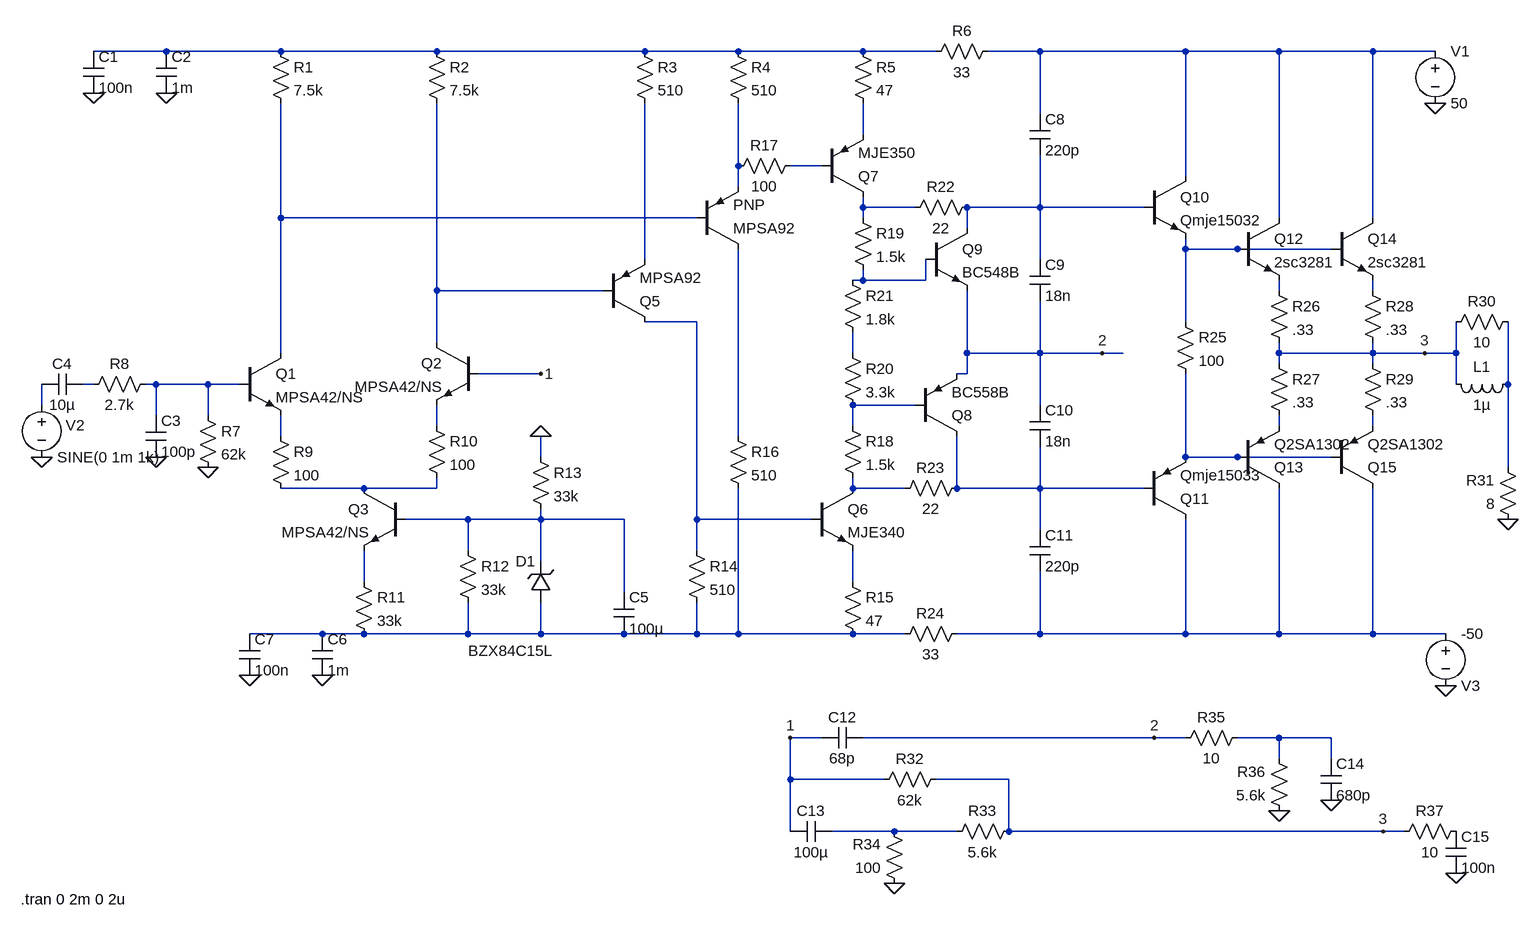
[diagram p0: schematic ampli.asc]
ampli.asc, the LTspice schematic file:
Version 4
SHEET 1 880 872
WIRE -35920 -448 -36032 -448
WIRE -35744 -448 -35920 -448
WIRE -35504 -448 -35744 -448
WIRE -35184 -448 -35504 -448
WIRE -35040 -448 -35184 -448
WIRE -34848 -448 -35040 -448
WIRE -34736 -448 -34848 -448
WIRE -34576 -448 -34656 -448
WIRE -34352 -448 -34576 -448
WIRE -34208 -448 -34352 -448
WIRE -34064 -448 -34208 -448
WIRE -33968 -448 -34064 -448
WIRE -34576 -352 -34576 -448
WIRE -34848 -320 -34848 -368
WIRE -35040 -272 -35040 -368
WIRE -34912 -272 -34960 -272
WIRE -34352 -256 -34352 -448
WIRE -35040 -240 -35040 -272
WIRE -34848 -208 -34848 -224
WIRE -34768 -208 -34848 -208
WIRE -34576 -208 -34576 -288
WIRE -34576 -208 -34688 -208
WIRE -34416 -208 -34576 -208
WIRE -35744 -192 -35744 -368
WIRE -35104 -192 -35744 -192
WIRE -34848 -192 -34848 -208
WIRE -34208 -192 -34208 -448
WIRE -34064 -192 -34064 -448
WIRE -34688 -176 -34688 -208
WIRE -34352 -144 -34352 -160
WIRE -34272 -144 -34352 -144
WIRE -34128 -144 -34272 -144
WIRE -35184 -128 -35184 -368
WIRE -34576 -128 -34576 -208
WIRE -34848 -96 -34848 -112
WIRE -34848 -96 -34864 -96
WIRE -34752 -96 -34752 -128
WIRE -34752 -96 -34848 -96
WIRE -35504 -80 -35504 -368
WIRE -35248 -80 -35504 -80
WIRE -34208 -80 -34208 -96
WIRE -34064 -80 -34064 -96
WIRE -35104 -32 -35184 -32
WIRE -34352 -32 -34352 -144
WIRE -35504 0 -35504 -80
WIRE -35744 16 -35744 -192
WIRE -34864 16 -34864 -16
WIRE -34688 16 -34688 -80
WIRE -34576 16 -34576 -64
WIRE -34576 16 -34688 16
WIRE -34480 16 -34576 16
WIRE -34448 16 -34480 16
WIRE -34208 16 -34208 0
WIRE -34064 16 -34064 0
WIRE -34064 16 -34208 16
WIRE -33984 16 -34064 16
WIRE -33936 16 -33936 -32
WIRE -33936 16 -33984 16
WIRE -34208 32 -34208 16
WIRE -34064 32 -34064 16
WIRE -35344 48 -35440 48
WIRE -34688 48 -34688 16
WIRE -34688 48 -34704 48
WIRE -36032 64 -36048 64
WIRE -35936 64 -35952 64
WIRE -35856 64 -35936 64
WIRE -35808 64 -35856 64
WIRE -33936 64 -33936 16
WIRE -33856 64 -33856 -32
WIRE -36112 96 -36112 64
WIRE -34768 96 -34864 96
WIRE -34576 96 -34576 16
WIRE -35936 112 -35936 64
WIRE -35856 112 -35856 64
WIRE -35504 128 -35504 96
WIRE -34864 128 -34864 96
WIRE -34208 128 -34208 112
WIRE -34064 128 -34064 112
WIRE -35744 144 -35744 112
WIRE -35040 144 -35040 -144
WIRE -35344 176 -35344 144
WIRE -34352 176 -34352 48
WIRE -34272 176 -34352 176
WIRE -34128 176 -34272 176
WIRE -33856 192 -33856 64
WIRE -35616 224 -35744 224
WIRE -35504 224 -35504 208
WIRE -35504 224 -35616 224
WIRE -34864 224 -34864 208
WIRE -34784 224 -34864 224
WIRE -34704 224 -34704 144
WIRE -34576 224 -34576 160
WIRE -34576 224 -34704 224
WIRE -34416 224 -34576 224
WIRE -35456 272 -35552 272
WIRE -35344 272 -35344 256
WIRE -35344 272 -35456 272
WIRE -35216 272 -35344 272
WIRE -35104 272 -35104 -32
WIRE -34928 272 -35104 272
WIRE -34576 288 -34576 224
WIRE -35456 320 -35456 272
WIRE -35104 320 -35104 272
WIRE -35344 336 -35344 272
WIRE -35616 368 -35616 320
WIRE -34864 368 -34864 320
WIRE -35216 384 -35216 272
WIRE -35680 448 -35792 448
WIRE -35616 448 -35680 448
WIRE -35456 448 -35456 400
WIRE -35456 448 -35616 448
WIRE -35344 448 -35344 400
WIRE -35344 448 -35456 448
WIRE -35216 448 -35344 448
WIRE -35104 448 -35104 400
WIRE -35104 448 -35216 448
WIRE -35040 448 -35040 224
WIRE -35040 448 -35104 448
WIRE -34864 448 -35040 448
WIRE -34784 448 -34864 448
WIRE -34576 448 -34576 352
WIRE -34576 448 -34704 448
WIRE -34352 448 -34352 272
WIRE -34352 448 -34576 448
WIRE -34208 448 -34208 224
WIRE -34208 448 -34352 448
WIRE -34064 448 -34064 224
WIRE -34064 448 -34208 448
WIRE -33952 448 -34064 448
WIRE -34912 608 -34960 608
WIRE -34400 608 -34848 608
WIRE -34352 608 -34400 608
WIRE -34208 608 -34272 608
WIRE -34128 608 -34208 608
WIRE -34208 640 -34208 608
WIRE -34128 640 -34128 608
WIRE -34960 672 -34960 608
WIRE -34816 672 -34960 672
WIRE -34624 672 -34736 672
WIRE -34960 752 -34960 672
WIRE -34800 752 -34896 752
WIRE -34704 752 -34800 752
WIRE -34624 752 -34624 672
WIRE -34048 752 -34624 752
WIRE -34016 752 -34048 752
FLAG -35920 -384 0
FLAG -36032 -384 0
FLAG -36112 176 0
FLAG -35936 176 0
FLAG -35856 192 0
FLAG -35344 144 0
FLAG -35792 512 0
FLAG -35680 512 0
FLAG -33968 -368 0
FLAG -33952 528 0
FLAG -33856 272 0
FLAG -35344 48 1
FLAG -34480 16 2
FLAG -33984 16 3
FLAG -34800 832 0
FLAG -34208 720 0
FLAG -34128 704 0
FLAG -34960 608 1
FLAG -34400 608 2
FLAG -33936 816 0
FLAG -34048 752 3
SYMBOL cap -36048 -448 R0
SYMATTR InstName C1
SYMATTR Value 100n
SYMBOL cap -35936 -448 R0
SYMATTR InstName C2
SYMATTR Value 1m
SYMBOL res -35760 -464 R0
SYMATTR InstName R1
SYMATTR Value 7.5k
SYMBOL res -35520 -464 R0
SYMATTR InstName R2
SYMATTR Value 7.5k
SYMBOL res -35200 -464 R0
SYMATTR InstName R3
SYMATTR Value 510
SYMBOL res -35056 -464 R0
SYMATTR InstName R4
SYMATTR Value 510
SYMBOL res -34864 -464 R0
SYMATTR InstName R5
SYMATTR Value 47
SYMBOL res -34640 -464 R90
WINDOW 0 0 56 VBottom 2
WINDOW 3 32 56 VTop 2
SYMATTR InstName R6
SYMATTR Value 33
SYMBOL voltage -33968 -464 R0
SYMATTR InstName V1
SYMATTR Value 50
SYMBOL npn -35808 16 R0
SYMATTR InstName Q1
SYMATTR Value MPSA42/NS
SYMBOL npn -35440 0 M0
SYMATTR InstName Q2
SYMATTR Value MPSA42/NS
SYMBOL cap -35952 112 R0
SYMATTR InstName C3
SYMATTR Value 100p
SYMBOL res -35872 96 R0
SYMATTR InstName R7
SYMATTR Value 62k
SYMBOL res -35936 48 R90
WINDOW 0 0 56 VBottom 2
WINDOW 3 32 56 VTop 2
SYMATTR InstName R8
SYMATTR Value 2.7k
SYMBOL voltage -36112 80 R0
WINDOW 0 37 47 Left 2
WINDOW 123 0 0 Left 2
WINDOW 39 0 0 Left 2
SYMATTR InstName V2
SYMATTR Value SINE(0 1m 1k)
SYMBOL cap -36048 48 R90
WINDOW 0 0 32 VBottom 2
WINDOW 3 32 32 VTop 2
SYMATTR InstName C4
SYMATTR Value 10µ
SYMBOL res -35760 128 R0
SYMATTR InstName R9
SYMATTR Value 100
SYMBOL res -35520 112 R0
SYMATTR InstName R10
SYMATTR Value 100
SYMBOL npn -35552 224 M0
SYMATTR InstName Q3
SYMATTR Value MPSA42/NS
SYMBOL res -35632 352 R0
SYMATTR InstName R11
SYMATTR Value 33k
SYMBOL res -35472 304 R0
SYMATTR InstName R12
SYMATTR Value 33k
SYMBOL res -35360 160 R0
SYMATTR InstName R13
SYMATTR Value 33k
SYMBOL zener -35328 400 R180
WINDOW 0 24 64 Left 2
WINDOW 3 -4 -74 Left 2
SYMATTR InstName D1
SYMATTR Value BZX84C15L
SYMBOL cap -35232 384 R0
SYMATTR InstName C5
SYMATTR Value 100µ
SYMBOL cap -35696 448 R0
SYMATTR InstName C6
SYMATTR Value 1m
SYMBOL cap -35808 448 R0
SYMATTR InstName C7
SYMATTR Value 100n
SYMBOL pnp -35104 -144 M180
SYMATTR InstName MPSA92
SYMBOL pnp -35248 -32 M180
SYMATTR InstName Q5
SYMATTR Value MPSA92
SYMBOL res -35120 304 R0
SYMATTR InstName R14
SYMATTR Value 510
SYMBOL res -34880 352 R0
SYMATTR InstName R15
SYMATTR Value 47
SYMBOL npn -34928 224 R0
SYMATTR InstName Q6
SYMATTR Value MJE340
SYMBOL res -35056 128 R0
SYMATTR InstName R16
SYMATTR Value 510
SYMBOL res -34944 -288 R90
WINDOW 0 0 56 VBottom 2
WINDOW 3 32 56 VTop 2
SYMATTR InstName R17
SYMATTR Value 100
SYMBOL pnp -34912 -224 M180
SYMATTR InstName Q7
SYMATTR Value MJE350
SYMBOL res -34880 112 R0
SYMATTR InstName R18
SYMATTR Value 1.5k
SYMBOL res -34864 -208 R0
SYMATTR InstName R19
SYMATTR Value 1.5k
SYMBOL res -34880 0 R0
SYMATTR InstName R20
SYMATTR Value 3.3k
SYMBOL res -34880 -112 R0
SYMATTR InstName R21
SYMATTR Value 1.8k
SYMBOL res -34672 -224 R90
WINDOW 0 0 56 VBottom 2
WINDOW 3 32 56 VTop 2
SYMATTR InstName R22
SYMATTR Value 22
SYMBOL res -34688 208 R90
WINDOW 0 0 56 VBottom 2
WINDOW 3 32 56 VTop 2
SYMATTR InstName R23
SYMATTR Value 22
SYMBOL pnp -34768 144 M180
SYMATTR InstName Q8
SYMATTR Value BC558B
SYMBOL npn -34752 -176 R0
SYMATTR InstName Q9
SYMATTR Value BC548B
SYMBOL res -34688 432 R90
WINDOW 0 0 56 VBottom 2
WINDOW 3 32 56 VTop 2
SYMATTR InstName R24
SYMATTR Value 33
SYMBOL cap -34592 -352 R0
SYMATTR InstName C8
SYMATTR Value 220p
SYMBOL cap -34592 -128 R0
SYMATTR InstName C9
SYMATTR Value 18n
SYMBOL cap -34592 96 R0
SYMATTR InstName C10
SYMATTR Value 18n
SYMBOL cap -34592 288 R0
SYMATTR InstName C11
SYMATTR Value 220p
SYMBOL npn -34416 -256 R0
SYMATTR InstName Q10
SYMATTR Value Qmje15032
SYMBOL pnp -34416 272 M180
SYMATTR InstName Q11
SYMATTR Value Qmje15033
SYMBOL res -34368 -48 R0
SYMATTR InstName R25
SYMATTR Value 100
SYMBOL res -34224 -96 R0
SYMATTR InstName R26
SYMATTR Value .33
SYMBOL res -34224 16 R0
SYMATTR InstName R27
SYMATTR Value .33
SYMBOL npn -34272 -192 R0
SYMATTR InstName Q12
SYMATTR Value 2sc3281
SYMBOL pnp -34272 224 M180
SYMATTR InstName Q13
SYMATTR Value Q2SA1302
SYMBOL res -34080 -96 R0
SYMATTR InstName R28
SYMATTR Value .33
SYMBOL res -34080 16 R0
SYMATTR InstName R29
SYMATTR Value .33
SYMBOL npn -34128 -192 R0
SYMATTR InstName Q14
SYMATTR Value 2sc3281
SYMBOL pnp -34128 224 M180
SYMATTR InstName Q15
SYMATTR Value Q2SA1302
SYMBOL voltage -33952 432 R0
WINDOW 0 24 96 Left 2
WINDOW 3 24 16 Left 2
WINDOW 123 0 0 Left 2
WINDOW 39 0 0 Left 2
SYMATTR InstName V3
SYMATTR Value -50
SYMBOL ind -33840 48 R90
WINDOW 0 5 56 VBottom 2
WINDOW 3 32 56 VTop 2
SYMATTR InstName L1
SYMATTR Value 1µ
SYMBOL res -33840 -48 R90
WINDOW 0 0 56 VBottom 2
WINDOW 3 32 56 VTop 2
SYMATTR InstName R30
SYMATTR Value 10
SYMBOL res -33840 288 R180
WINDOW 0 36 76 Left 2
WINDOW 3 36 40 Left 2
SYMATTR InstName R31
SYMATTR Value 8
SYMBOL cap -34848 592 R90
WINDOW 0 0 32 VBottom 2
WINDOW 3 32 32 VTop 2
SYMATTR InstName C12
SYMATTR Value 68p
SYMBOL cap -34896 736 R90
WINDOW 0 0 32 VBottom 2
WINDOW 3 32 32 VTop 2
SYMATTR InstName C13
SYMATTR Value 100µ
SYMBOL res -34720 656 R90
WINDOW 0 0 56 VBottom 2
WINDOW 3 32 56 VTop 2
SYMATTR InstName R32
SYMATTR Value 62k
SYMBOL res -34608 736 R90
WINDOW 0 0 56 VBottom 2
WINDOW 3 32 56 VTop 2
SYMATTR InstName R33
SYMATTR Value 5.6k
SYMBOL res -34784 848 R180
WINDOW 0 36 76 Left 2
WINDOW 3 36 40 Left 2
SYMATTR InstName R34
SYMATTR Value 100
SYMBOL res -34256 592 R90
WINDOW 0 0 56 VBottom 2
WINDOW 3 32 56 VTop 2
SYMATTR InstName R35
SYMATTR Value 10
SYMBOL res -34192 736 R180
WINDOW 0 36 76 Left 2
WINDOW 3 36 40 Left 2
SYMATTR InstName R36
SYMATTR Value 5.6k
SYMBOL cap -34144 640 R0
SYMATTR InstName C14
SYMATTR Value 680p
SYMBOL res -33920 736 R90
WINDOW 0 0 56 VBottom 2
WINDOW 3 32 56 VTop 2
SYMATTR InstName R37
SYMATTR Value 10
SYMBOL cap -33952 752 R0
SYMATTR InstName C15
SYMATTR Value 100n
TEXT -36144 856 Left 2 !.tran 0 2m 0 2u

The netlist it stands for:
* ampli.asc
C1 N001 0 100n
C2 N001 0 1m
R1 N001 N008 7.5k
R2 N001 N012 7.5k
R3 N001 N010 510
R4 N001 N004 510
R5 N001 N003 47
R6 N002 N001 33
V1 N002 0 50
Q1 N008 N018 N025 0 MPSA42/NS
Q2 N012 1 N022 0 MPSA42/NS
C3 N018 0 100p
R7 N018 0 62k
R8 N018 N017 2.7k
V2 N020 0 SINE(0 1m 1k)
C4 N017 N020 10µ
R9 N025 N028 100
R10 N022 N028 100
Q3 N028 N031 N032 0 MPSA42/NS
R11 N032 N034 33k
R12 N031 N034 33k
R13 0 N031 33k
D1 N034 N031 BZX84C15L
C5 N031 N034 100µ
C6 N034 0 1m
C7 N034 0 100n
Q§MPSA92 N026 N008 N004 0 PNP
Q5 N015 N012 N010 0 MPSA92
R14 N015 N034 510
R15 N033 N034 47
Q6 N029 N015 N033 0 MJE340
R16 N026 N034 510
R17 N005 N004 100
Q7 N006 N005 N003 0 MJE350
R18 N021 N029 1.5k
R19 N006 N011 1.5k
R20 N016 N021 3.3k
R21 N011 N016 1.8k
R22 N007 N006 22
R23 N030 N029 22
Q8 N030 N021 2 0 BC558B
Q9 N007 N011 2 0 BC548B
R24 N035 N034 33
C8 N002 N007 220p
C9 N007 2 18n
C10 2 N030 18n
C11 N030 N035 220p
Q10 N002 N007 N009 0 Qmje15032
Q11 N035 N030 N027 0 Qmje15033
R25 N009 N027 100
R26 N013 3 .33
R27 3 N023 .33
Q12 N002 N009 N013 0 2sc3281
Q13 N035 N027 N023 0 Q2SA1302
R28 N014 3 .33
R29 3 N024 .33
Q14 N002 N009 N014 0 2sc3281
Q15 N035 N027 N024 0 Q2SA1302
V3 N035 0 -50
L1 N019 3 1µ
R30 N019 3 10
R31 0 N019 8
C12 2 1 68p
C13 N037 1 100µ
R32 3 1 62k
R33 3 N037 5.6k
R34 0 N037 100
R35 N036 2 10
R36 0 N036 5.6k
C14 N036 0 680p
R37 P001 3 10
C15 P001 0 100n
.model D D
.lib standard.dio
.model NPN NPN
.model PNP PNP
.lib standard.bjt
.tran 0 2m 0 2u
.backanno
.end